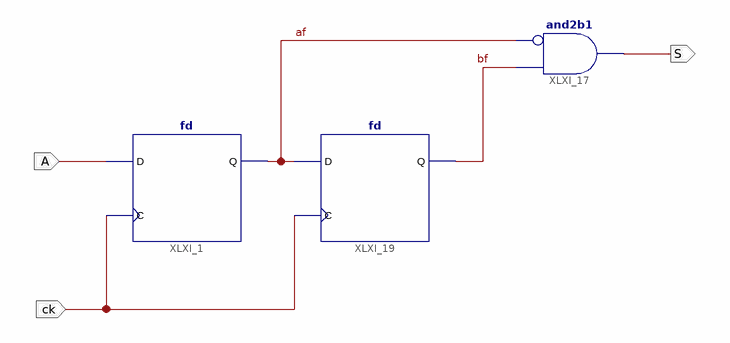
[diagram p0: schematic sheet 1]
// Xilinx ISE schematic p_fin.sch (spartan6) as structural Verilog: 3 symbols, 3 ports
module p_fin (
  input  A,
  input  ck,
  output S
);

  wire af, bf;

  fd XLXI_1 (.C(ck), .D(A), .Q(af));
  fd XLXI_19 (.C(ck), .D(af), .Q(bf));
  and XLXI_17 (S, ~af, bf);  // and2b1
endmodule
